# Altium project CTRL_Board.PrjPcb
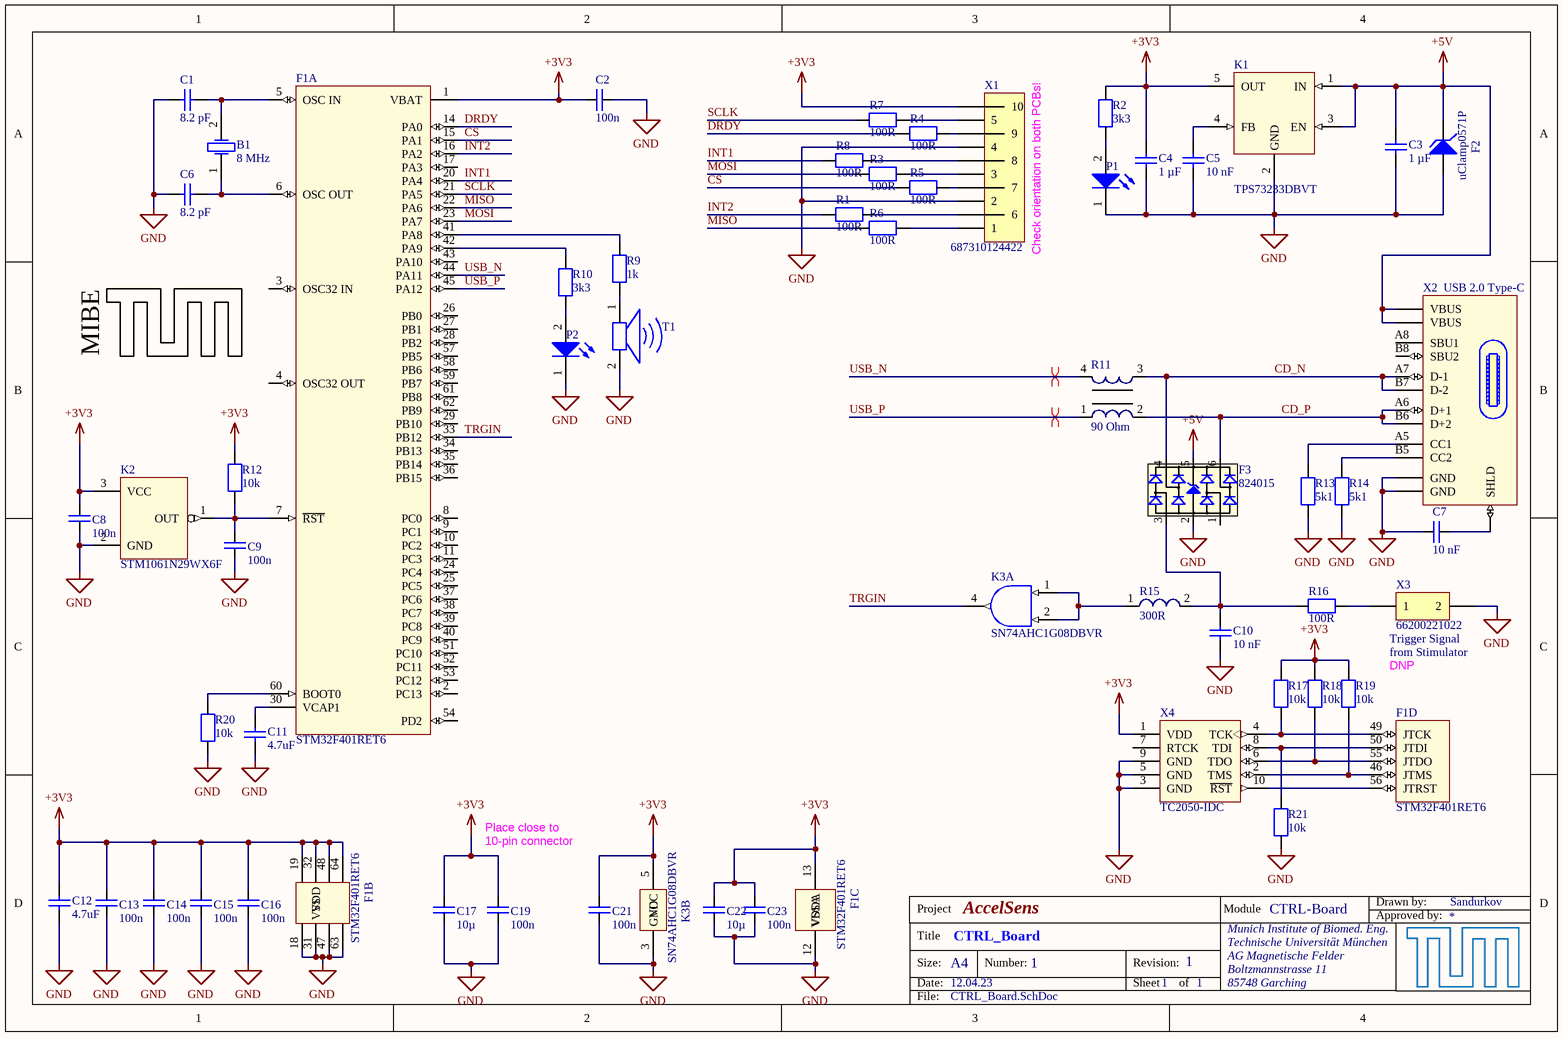
[diagram p0: CTRL_Board.SchDoc]
1 sheet, 57 parts. Net scope: global (net labels, ports and power ports of the same name join across sheets).
Board file: CTRL_Board.PcbDoc

## Sheet CTRL_Board.SchDoc: CTRL_Board
size A4; Date: 12.04.23; Engineer: Sandurkov; DocumentNumber: 1; Revision: 1; SheetNumber: 1; SheetTotal: 1; Module: CTRL-Board; Device: AccelSens

### Parts
*1  TUM & MIBE Logo  [TUM & MIBE Logo]  (value not drawn)  (no BOM)
B1  8 MHz  [DFN190P320X100-2N]
C1  8.2 pF  [CAPC1608X09N]
C2  100n  [CAPC1608X08N]
C3  1 µF  [CAPC2012X14N]
C4  1 µF  [CAPC2012X14N]
C5  10 nF  [CAPC2012X09N]
C6  8.2 pF  [CAPC1608X09N]
C7  10 nF  [0603 (1608x90N), h = 0.9 mm]
C8  100n  [CAPC1608X08N]
C9  100n  [CAPC1608X08N]
C10  10 nF  [CAPC2012X09N]
C11  4.7uF  [CAPC2012X09N]
C12  4.7uF  [CAPC2012X09N]
C13  100n  [CAPC1608X08N]
C14  100n  [CAPC1608X08N]
C15  100n  [CAPC1608X08N]
C16  100n  [CAPC1608X08N]
C17  10µ  [CAPC2012X14N]
C19  100n  [CAPC1608X08N]
C21  100n  [CAPC1608X08N]
C22  10µ  [CAPC2012X14N]
C23  100n  [CAPC1608X08N]
F1  STM32F401RET6  [LQFP-64]  (parts A,B,C,D of 4)
F2  uClamp0571P  [DFN110P160X55-2N]
F3  824015  [SOT23_6L]
K1  TPS73233DBVT  [SOT95P280X145-5N]
K2  STM1061N29WX6F  [SOT95P237X112-3N]
K3  SN74AHC1G08DBVR  [SOT95P280X145-5N]  (parts A,B of 2)
P1  green  [WL-SMCW_0603]  (value not drawn)
P2  green  [WL-SMCW_0603]  (value not drawn)
R1  100R  [RESC1608X05N]
R2  3k3  [RESC1608X05N]
R3  100R  [RESC1608X05N]
R4  100R  [RESC1608X05N]
R5  100R  [RESC1608X05N]
R6  100R  [RESC1608X05N]
R7  100R  [RESC1608X05N]
R8  100R  [RESC1608X05N]
R9  1k  [RESC1608X05N]
R10  3k3  [RESC1608X05N]
R11  90 Ohm  [WE-CNSW, 1206]
R12  10k  [RESC1608X05N]
R13  5k1  [RES0603]
R14  5k1  [RES0603]
R15  300R  [0603 (WE-CBF)]
R16  100R  [RESC1608X05N]
R17  10k  [RESC1608X05N]
R18  10k  [RESC1608X05N]
R19  10k  [RESC1608X05N]
R20  10k  [RESC1608X05N]
R21  10k  [RESC1608X05N]
T1  Summer  [PKLCS1212E4001-R1]  (value not drawn)
X1  687310124422  [687310124422]
X2  USB 2.0 Type-C  [629722000214]
X3  66200221022  [66200221022]
X4  TC2050-IDC  [TC2050-IDC]

### Nets
+3V3: C2.1 C4.1 C8.1 C12.1 C13.1 C14.1 C15.1 C16.1 C17.1 C19.1 C21.1 C22.1 C23.1 F1.1(VBAT) F1.13(VDDA) F1.19(VDD) F1.32(VDD) F1.48(VDD) F1.64(VDD) K1.5(OUT) K2.3(VCC) K3.5(VCC) R2.1 R12.1 R17.1 R18.1 R19.1 X1.10 X4.1(VDD)
+5V: C3.1 F2.1(C) F3.5(VDD) K1.1(IN) K1.3(EN) X2.VBUS
GND: C1.1 C2.2 C3.2 C4.2 C5.2 C6.1 C7.1 C8.2 C9.2 C10.2 C11.2 C12.2 C13.2 C14.2 C15.2 C16.2 C17.2 C19.2 C21.2 C22.2 C23.2 F1.12(VSSA) F1.18(VSS) F1.31(VSS) F1.47(VSS) F1.63(VSS) F2.2(A) F3.2(GND) K1.2(GND) K2.2(GND) K3.3(GND) P1.1(K) P2.1(K) R13.2 R14.2 R20.2 R21.2 T1.2 X1.2 X1.4 X2.GND X3.2 X4.3(GND) X4.5(GND) X4.9(GND)
CD_N: F3.4(I/O3) R11.3 X2.A7(D-1) X2.B7(D-2)
CD_P: F3.6(I/O4) R11.2 X2.A6(D+1) X2.B6(D+2)
CS: F1.15(PA1) R5.2
DRDY: F1.14(PA0) R4.2
INT1: F1.20(PA4) R8.2
INT2: F1.16(PA2) R1.2
MISO: F1.22(PA6) R6.2
MOSI: F1.23(PA7) R3.2
SCLK: F1.21(PA5) R7.2
TRGIN: F1.33(PB12) K3.4(Y)
USB_N: F1.44(PA11) R11.4
USB_P: F1.45(PA12) R11.1
NetB1_1: B1.1 C6.2 F1.6(OSC_OUT)
NetB1_2: B1.2 C1.2 F1.5(OSC_IN)
NetC5_1: C5.1 K1.4(FB)
NetC7_2: C7.2 X2.1(SHLD)
NetC9_1: C9.1 F1.7(~{RST}) K2.1(OUT) R12.2
NetC10_1: C10.1 F3.3(I/O2) R15.2 R16.1
NetC11_1: C11.1 F1.30(VCAP1)
NetF1_41: F1.41(PA8) R9.1
NetF1_42: F1.42(PA9) R10.2
NetF1_46: F1.46(JTMS) R19.2 X4.2(TMS)
NetF1_49: F1.49(JTCK) R17.2 X4.4(TCK)
NetF1_50: F1.50(JTDI) R21.1 X4.8(TDI)
NetF1_55: F1.55(JTDO) R18.2 X4.6(TDO)
NetF1_56: F1.56(JTRST) X4.10(~{RST})
NetF1_60: F1.60(BOOT0) R20.1
NetK3_1: K3.1(A) K3.2(B) R15.1
NetP1_2: P1.2(A) R2.2
NetP2_2: P2.2(A) R10.1
NetR1_1: R1.1 X1.6
NetR3_1: R3.1 X1.3
NetR4_1: R4.1 X1.9
NetR5_1: R5.1 X1.7
NetR6_1: R6.1 X1.1
NetR7_1: R7.1 X1.5
NetR8_1: R8.1 X1.8
NetR9_2: R9.2 T1.1
NetR13_1: R13.1 X2.A5(CC1)
NetR14_1: R14.1 X2.B5(CC2)
NetR16_2: R16.2 X3.1

Not connected (* = marked no-connect by the designer): F1 2(PC13) 3(OSC32_IN) 4(OSC32_OUT) 8(PC0) 9(PC1) 10(PC2) 11(PC3) 17(PA3) 24(PC4) 25(PC5) 26(PB0) 27(PB1) 28(PB2) 29(PB10) 34(PB13) 35(PB14) 36(PB15) 37(PC6) 38(PC7) 39(PC8) 40(PC9) 43(PA10) 51(PC10) 52(PC11) 53(PC12) 54(PD2) 57(PB5) 58(PB6) 59(PB7) 61(PB8) 62(PB9); F3 1(I/O1); X2 A8(SBU1) B8(SBU2); X4 7(RTCK)

### Layout directives
differential pair: USB_N, USB_P

### Notes on the sheet
- (near X1) Check orientation on both PCBs!
- (near X3) Trigger Signal
- from Stimulator
- DNP
- Place close to
- 10-pin connector
- Project
- Module
- Drawn by:
- Approved by:
- Title
- Size:
- Date:
- A4
- Number:
- Revision:
- Sheet
- of
- Munich Institute of Biomed. Eng.
- Technische Universität München
- AG Magnetische Felder
- Boltzmannstrasse 11
- 85748 Garching
- File:
- (in symbol TUM & MIBE Logo) MIBE

### Library data of the parts
B1 = NX3225GD-8MHZ-STD-CRA-3: Crystal, 8 MHz, 8 pF, NX3225GD; ComponentLink1Description: Datasheet; ComponentLink1URL: http://www.ndk.com/images/products/catalog/c_NX3225GD-STD-CRA-3_e.pdf
C1 C6 = C0603C829C5GACTU: 8.2 pF, 50 V, 5%, C0G, 0805; PackageReference: 0805; PackageDescription: Chip Capacitor, 2-Leads, Body 2,00x1,25mm, IPC Medium Density; Value: 8.2 pF; Supplier 1: Farnell; Supplier Part Number 1: 1865471; ComponentLink1Description: datasheet; ComponentLink1URL: http://www.farnell.com/datasheets/1691965.pdf?src-supplier=Element14
C2 C8 C9 C13-C16 C19 C21 C23 = C0603C104K5RACTU: 100n, 0603, X7R, 10%, 50 V; Manufacturer: Kemet; Voltage Rating: 50 V; Dielectric: X7R; Value: 100n; Tolerance: 10%; ComponentLink1Description: Datasheet; ComponentLink1URL: http://www.farnell.com/datasheets/1851736.pdf
  C2 C8 C9 C19 C21 C23: Supplier 1: Digi-Key; Supplier 2: Farnell; Supplier 3: Mouser; Supplier Part Number 1: 399-5089-1-ND; Supplier Part Number 2: 1288255; Supplier Part Number 3: 80-C0603C104K5R
C3 C4 = C0805C105K3RACTU: 1 µF, 25 V, 10%, X7R, 0805; PackageReference: 0805; PackageDescription: Chip Capacitor, 2-Leads, Body 2,00x1,25mm, IPC Medium Density; Value: 1 µF; Supplier 1: Digi-Key; Supplier 2: Farnell; Supplier 3: Mouser; Supplier Part Number 1: 399-8004-6-ND; Supplier Part Number 2: 1637035; Supplier Part Number 3: 80-C0805C105K3R; ComponentLink1Description: datasheet; ComponentLink1URL: https://content.kemet.com/datasheets/KEM_C1002_X7R_SMD.pdf
C5 C10 = C0805C103K5RACTU: 10 nF, 50 V, 10%, X7R, 0805; PackageReference: 0805; PackageDescription: Chip Capacitor, 2-Leads, Body 2,00x1,25mm, IPC Medium Density; Value: 10 nF; Supplier 1: Farnell; Supplier Part Number 1: 1414662; ComponentLink1Description: datasheet; ComponentLink1URL: https://datasheet.octopart.com/C0805C103K5RAC-TU-Kemet-datasheet-5313890.pdf
C7 = CC0603KRX7R9BB103: 10 nF, 50 V, 10%, X7R, 0603; Manufacturer: Yageo; Material: Ceramic; Capacitance: 10nF; Voltage Rating: 50V; Insulation Resistance: 100GR; Supplier 1: Future Electronics; Manufacturer Part Number: CC0603KRX7R9BB103; RoHS: Yes; Category: Ceramic Capacitors; Stock 1: 11624000; Pricing 1: 4000=0,00400, 20000=0,00380, 80000=0,00360, 200000=0,00350, 500000=0,00320 (USD); Mount: Surface Mount; Case/Package: 0603; Number of Pins: 2; Case Code (Metric): 1608; Case Code (Imperial): 0603; Min Operating Temperature: -55°C; Max Operating Temperature: 125°C; Tolerance: 10%; Packaging: Tape and Reel; Dielectric: X7R; Voltage: 50V; Voltage Rating (DC): 50V; Package Quantity: 1; Termination: SMD/SMT; Resistor Type: Ceramic; Series: CC; Length: 1.6mm; Width: 0.031inch; Height: 0.8mm; Thickness: 0.035inch; Depth: 0.8mm; Radiation Hardening: No; RoHS Compliant: Yes; Lead Free: Lead Free; Halogen Free: Halogen Free; ComponentLink1URL: https://datasheet.ciiva.com/11788/0900766b8079c870-11788374.pdf?src-supplier=Rs; ComponentLink1Description: https://datasheet.ciiva.com/11788/0900766b8079c870-11788374.pdf?src-supplier=Rs; ComponentLink2URL: https://datasheet.ciiva.com/26862/getdatasheetpartid-403582-26862846.pdf?src-supplier=Verical; ComponentLink2Description: https://datasheet.ciiva.com/26862/getdatasheetpartid-403582-26862846.pdf?src-supplier=Verical; ComponentLink3URL: https://datasheet.ciiva.com/8033/70765-8033817.pdf?src-supplier=Element14; ComponentLink3Description: https://datasheet.ciiva.com/8033/70765-8033817.pdf?src-supplier=Element14; ComponentLink4URL: https://datasheet.ciiva.com/28450/1489800-28450619.pdf?src-supplier=Element14; ComponentLink4Description: https://datasheet.ciiva.com/28450/1489800-28450619.pdf?src-supplier=Element14; ComponentLink5URL: https://datasheet.ciiva.com/176/mlccorderingcode-176551.pdf?src-supplier=Digi-Key; ComponentLink5Description: https://datasheet.ciiva.com/176/mlccorderingcode-176551.pdf?src-supplier=Digi-Key; ComponentLink6URL: https://datasheet.ciiva.com/176/mlccorderingcode-176550.pdf?src-supplier=Digi-Key; ComponentLink6Description: https://datasheet.ciiva.com/176/mlccorderingcode-176550.pdf?src-supplier=Digi-Key; ComponentLink7URL: https://datasheet.ciiva.com/176/mlccorderingcode-176552.pdf?src-supplier=Digi-Key; ComponentLink7Description: https://datasheet.ciiva.com/176/mlccorderingcode-176552.pdf?src-supplier=Digi-Key; ComponentLink8URL: https://datasheet.ciiva.com/13389/upy-gphc-x7r-6-3v-to-50v-8-13389991.pdf?src-supplier=Mouser; ComponentLink8Description: https://datasheet.ciiva.com/13389/upy-gphc-x7r-6-3v-to-50v-8-13389991.pdf?src-supplier=Mouser; ComponentLink9URL: https://datasheet.ciiva.com/8033/1734573-8033816.pdf?src-supplier=Element14; ComponentLink9Description: https://datasheet.ciiva.com/8033/1734573-8033816.pdf?src-supplier=Element14; ComponentLink10URL: https://datasheet.ciiva.com/8033/1734573-8033861.pdf?src-supplier=Element14; ComponentLink10Description: https://datasheet.ciiva.com/8033/1734573-8033861.pdf?src-supplier=Element14
C11 C12 = C0805C475K4PACTU: 4.7 µF, ± 10%, X5R, 16 V, 0805; PackageReference: 0805; PackageDescription: Chip Capacitor, 2-Leads, Body 2,00x1,25mm, IPC Medium Density; Value: 4.7uF; Supplier 1: Digi-Key; Supplier Part Number 1: 399-8101-2-ND; Supplier 2: Farnell; Supplier Part Number 2: 9227849; ComponentLink1Description: datasheet; ComponentLink1URL: http://www.farnell.com/datasheets/2739660.pdf?_ga=2.240630531.1432735279.1579189766-674608839.1579189766&_gac=1.140641798.1579263811.EAIaIQobChMIzJSvkNCK5wIVleJ3Ch2EjwqfEAAYASAAEgKpevD_BwE
C17 C22 = C0805C106K4PACTU: 10µ, 0805, X5R, 10%, 16 V; Manufacturer: Kemet; Voltage Rating: 16 V; Dielectric: X5R; Value: 10µ; Tolerance: 10%; ComponentLink1Description: Datasheet; ComponentLink1URL: http://www.farnell.com/datasheets/1732713.pdf; Supplier 1: Digi-Key; Supplier 2: Farnell; Supplier 3: Mouser; Supplier Part Number 1: 399-8012-1-ND; Supplier Part Number 2: 1288204; Supplier Part Number 3: 80-C0805C106K4P
F1 = STM32F401RET6: M4, 512 kB, 84 MHz; Manufacturer: STMicroelectronics; Interface: I2C,SPI,USB,IrDA,SDIO,UART,USART,LIN,I2S; Data Bus Width: 32b; Core Architecture: ARM; Operating Supply Voltage: 3.3V; Min Supply Voltage: 1.7V; Max Supply Voltage: 3.6V; RAM Size: 96KB; Number of I/Os: 50; Frequency: 84MHz; Memory Size: 512KB; Max Power Dissipation: 313mW; Number of Timers/Counters: 8; Oscillator Type: Internal; Watchdog Timer: Yes; Memory Type: FLASH; Peripherals: Brown-out Detect/Reset,POR,PWM,WDT,DMA; Supplier 1: Mouser; Manufacturer Part Number: STM32F401RET6; RoHS: Yes; Category: Microcontrollers; Stock 1: 9195; Pricing 1: 1=9,13, 10=8,26, 50=7,87, 100=6,84, 1000=5,06, 10000=5,06 (USD); Case/Package: LQFP; Number of Pins: 64; Weight: 0.012088oz; Min Operating Temperature: -40°C; Max Operating Temperature: 85°C; Packaging: Tray; Package Quantity: 960; Series: STM32 F4; Number of Programmable I/O: 50; Max Frequency: 84MHz; Radiation Hardening: No; Reach SVHC Compliant: No; Lead Free: Lead Free; RoHS Compliant: Yes; ComponentLink1URL: http://www.farnell.com/datasheets/1899788.pdf?src-supplier=Farnell; ComponentLink1Description: http://www.farnell.com/datasheets/1899788.pdf?src-supplier=Farnell; ComponentLink2URL: http://www.mouser.com/ds/2/389/stm32f401re-956236.pdf?src-supplier=Mouser; ComponentLink2Description: http://www.mouser.com/ds/2/389/stm32f401re-956236.pdf?src-supplier=Mouser; ComponentLink3URL: http://www.farnell.com/datasheets/1899788.pdf?src-supplier=Element14; ComponentLink3Description: http://www.farnell.com/datasheets/1899788.pdf?src-supplier=Element14; ComponentLink4URL: http://www.st.com/st-web-ui/static/active/en/resource/technical/document/datasheet/DM00102166.pdf?src-supplier=Avnet; ComponentLink4Description: http://www.st.com/st-web-ui/static/active/en/resource/technical/document/datasheet/DM00102166.pdf?src-supplier=Avnet; ComponentLink5URL: http://www.st.com/content/ccc/resource/technical/document/errata_sheet/df/f5/fd/26/37/db/42/2b/DM00095523.pdf/files/DM00095523.pdf/jcr:content/translations/en.DM00095523.pdf?src-supplier=Digi-Key; ComponentLink5Description: http://www.st.com/content/ccc/resource/technical/document/errata_sheet/df/f5/fd/26/37/db/42/2b/DM00095523.pdf/files/DM00095523.pdf/jcr:content/translations/en.DM00095523.pdf?src-supplier=Digi-Key; ComponentLink6URL: http://www.farnell.com/datasheets/1899788.pdf?src-supplier=Newark; ComponentLink6Description: http://www.farnell.com/datasheets/1899788.pdf?src-supplier=Newark
F2 = UCLAMP0571P.TNT: TVS DIODE 5V 15V SGP1610N2; Manufacturer: Semtech; Number of Unidirectional Channels: 1; Min Breakdown Voltage: 6V; Power Line Protection: No; Peak Pulse Current: 80A; Supplier 1: Digi-Key; Manufacturer Part Number: UCLAMP0571P.TNT; RoHS: Yes; Category: TVS Diodes; Stock 1: 30716; Pricing 1: 1=0,87000, 10=0,75800, 100=0,52470, 500=0,43842, 1000=0,37312, 2000=0,33231, 5000=0,31482 (USD); Mount: Surface Mount; Number of Pins: 2; Min Operating Temperature: -40°C; Max Operating Temperature: 125°C; Packaging: Tape and Reel; Reverse Standoff Voltage: 5V; Clamping Voltage: 15V; Resistor Type: Zener; ComponentLink1URL: https://media.digikey.com/pdf/Data%20Sheets/~No%20Display/Semtech%20PDFs/uClamp0571P-3671P.pdf?src-supplier=Digi-Key; ComponentLink1Description: https://media.digikey.com/pdf/Data%20Sheets/~No%20Display/Semtech%20PDFs/uClamp0571P-3671P.pdf?src-supplier=Digi-Key; ComponentLink2URL: http://www.mouser.com/ds/2/761/uclampxx71p_2-779780.pdf?src-supplier=Mouser; ComponentLink2Description: http://www.mouser.com/ds/2/761/uclampxx71p_2-779780.pdf?src-supplier=Mouser
F3 = WE-TVS-HS, 824015: TVS Diode WE-TVS-HS, VRWM=5V; Manufacturer: Würth Elektronik eiSos GmbH; Reverse Stand Off Voltage: 5V; Value: 824015; ComponentLink1Description: Manufacturer; ComponentLink1URL: http://www.we-online.de; Created by: Christin Zierenner; Created Date: March 2010; ComponentLink2Description: Datasheet; ComponentLink2URL: http://katalog.we-online.de/kataloge/eisos/media/pdf/824014.pdf; Supplier 1: Farnell; Supplier 2: Digi-Key; Supplier Part Number 1: 1748615; Supplier Part Number 2: 732-4467-1-ND
K1 = TPS73233DBVT: Low Noise, Positive Output LDO, 250 mA, 3.3V; Published: 15-May-2014; LatestRevisionDate: 15-May-2014; PackageReference: SOT23-5; Publisher: Stephan Huber; PackageDescription: SOT23, 5-Leads, Body 2,90x2,80mm, Pitch 0,95mm, IPC Medium Density; Value: TPS73233DBVT; Supplier 1: Digi-Key; Supplier Part Number 1: 296-15812-1-ND; ComponentLink1Description: datasheet; ComponentLink1URL: http://www.ti.com/lit/ds/symlink/tps732.pdf
K2 = STM1061N29WX6F: Low Power Voltage Detector, Open Drain, 2,9 V Threshold, SOT23-3; ComponentLink1Description: Datasheet; ComponentLink1URL: http://www.farnell.com/datasheets/1690459.pdf; Supplier 1: Digi-Key; Supplier 2: Farnell; Supplier 3: Mouser; Supplier Part Number 1: 497-4956-1-ND; Supplier Part Number 2: 1224452; Supplier Part Number 3: 511-STM1061N29WX6F
K3 = SN74AHC1G08DBVR: CMOS Single AND-Gate, AHC, 2 V - 5.5 V, 8 mA, Ultra High Speed; ComponentLink1Description: Datasheet; ComponentLink1URL: http://www.ti.com/lit/ds/symlink/sn74ahc1g08.pdf; Supplier 1: Digi-Key; Supplier 2: Mouser; Supplier Part Number 1: 296-1091-1-ND; Supplier Part Number 2: 595-SN74AHC1G08DBVR
P1 P2 = 150060VS75000: WL-SMCW LED, green, 30 mA, 2 V, 570 nmr, 0603, Bright Green,  140°; Forward Voltage: 2 V; Peak Wavelength: 572 nm; Dominant Wavelength: 570 nm; Luminous Intensity: 40 mcd; ComponentLink1Description: Manufacturer; ComponentLink1URL: http://www.we-online.de; ComponentLink2Description: Datasheet; ComponentLink2URL: http://katalog.we-online.de/led/datasheet/150060VS75000.pdf; Part Number: 150060VS75000; Published Date: March 2018; Publisher: Wurth Elektronik; Size: 0603; Viewing Angle: 140°; Operating Temperature: -40 to 85 degC; Emitting Color: Bright Green
R1 R3-R8 R16 = CRCW0603100RFKEAHP: 100R, 0603, 0.25 W, 1%, 75 V, pulse proof; Manufacturer: Vishay; Voltage Rating: 75 V; Power Rating: 0.25 W; Value: 100R; Tolerance: 1%; Series: CRCW-HP E3; ComponentLink1Description: datasheet; ComponentLink1URL: CRCW0603100RFKEAHP; Supplier 1: Digi-Key; Supplier 2: Farnell; Supplier 3: Mouser; Supplier Part Number 3: 71-CRCW0603100RFKEAH; Supplier Part Number 2: 1738891; Supplier Part Number 1: 541-100SCT-ND
R2 R10 = CRCW06033K30FKEA: 3k3, 0603, 0.1 W, 1%, 75 V; Manufacturer: Vishay; Voltage Rating: 75 V; Power Rating: 0.1 W; Value: 3k3; Tolerance: 1%; Series: D/CRCW E3
R9 = CRCW06031K00FKEA: 1k, 0603, 0.1 W, 1%, 75 V; Manufacturer: Vishay; Voltage Rating: 75 V; Power Rating: 0.1 W; Value: 1k; Tolerance: 1%; Series: D/CRCW E3; Supplier 1: Digi-Key; Supplier 2: Farnell; Supplier Part Number 1: 541-1.00KSCT-ND; Supplier Part Number 2: 2693105; ComponentLink1Description: datasheet; ComponentLink1URL: http://www.vishay.com/docs/20043/crcwhpe3.pdf?src-supplier=Digi-Key
R11 = WE-CNSW 1206, 744232090: SMD Common Mode Noise Suppressor WE-CNSW,  Z= 90 Ohm; Manufacturer: Würth Elektronik eiSos GmbH; partNo: 744232090; Impedance: 90 Ohm; ComponentLink1Description: Manufacturer; ComponentLink1URL: http://www.we-online.de; Created by: Christin Zierenner; Created Date: November 2009; ComponentLink2Description: Datasheet; ComponentLink2URL: http://www.we-online.de/katalog/media/pdf/744232090.pdf; Supplier 1: Digi-Key; Supplier 2: Farnell; Supplier 3: Mouser; Supplier Part Number 1: 732-1469-1-ND; Supplier Part Number 2: 1636474; Supplier Part Number 3: 710-744232090
R12 R20 = CRCW060310K0FKEA: 10k, 0603, 0.1 W, 1%, 75 V; Manufacturer: Vishay; Voltage Rating: 75 V; Power Rating: 0.1 W; Value: 10k; Tolerance: 1%; Series: D/CRCW E3; Supplier 1: Digi-Key; Supplier 2: Farnell; Supplier Part Number 1: 541-10.0KSCT-ND; Supplier Part Number 2: 1738918
R13 R14 = CRCW06035K10FKEA: 5k1, 0.1 W, 1%, 75 V, 0603; Manufacturer: Vishay; Resistance: 5.1kR; Temperature Coefficient: 100ppm/°C; Max Power Dissipation: 100mW; Voltage Rating: 75V; Supplier 1: Mouser; Manufacturer Part Number: CRCW06035K10FKEA; RoHS: Yes; Category: Chip SMD Resistors; Stock 1: 16936; Pricing 1: 1=0,1, 10=0,038, 50=0,038, 100=0,016, 1000=0,007, 10000=0,005 (USD); Case/Package: 0603; Contact Plating: Tin; Case Code (Imperial): 0603; Case Code (Metric): 1608; Weight: 7.1E-05oz; Size Code: 0603; Min Operating Temperature: -55°C; Max Operating Temperature: 155°C; Tolerance: 1%; Packaging: Tape and Reel; Series: CRCW; Number of Terminations: 2; Power Rating: 100mW; Package Quantity: 5000; Features: Automotive AEC-Q200; Construction: Rectangular; Resistor Type: Thick Film; Termination: SMD/SMT; Voltage Rating (DC): 75V; Resistance Tolerance: 1%; Technology: THICK FILM; Length: 1.55mm; Width: 0.85mm; Height: 0.45mm; Depth: 0.85mm; Radiation Hardening: No; Lead Free: Lead Free; RoHS Compliant: Yes; Military Standard: Not; Reach SVHC Compliant: Unknown; ComponentLink1URL: https://datasheet.ciiva.com/11809/0900766b80d98afc-11809935.pdf?src-supplier=Rs; ComponentLink1Description: https://datasheet.ciiva.com/11809/0900766b80d98afc-11809935.pdf?src-supplier=Rs; ComponentLink2URL: https://datasheet.ciiva.com/26314/fld-crcw-e3-data-en-26314742.pdf?src-supplier=Distrelec; ComponentLink2Description: https://datasheet.ciiva.com/26314/fld-crcw-e3-data-en-26314742.pdf?src-supplier=Distrelec; ComponentLink3URL: https://datasheet.ciiva.com/7690/1697337-7690728.pdf?src-supplier=Element14; ComponentLink3Description: https://datasheet.ciiva.com/7690/1697337-7690728.pdf?src-supplier=Element14; ComponentLink4URL: https://datasheet.ciiva.com/7690/1720486-7690873.pdf?src-supplier=Element14; ComponentLink4Description: https://datasheet.ciiva.com/7690/1720486-7690873.pdf?src-supplier=Element14; ComponentLink5URL: https://datasheet.ciiva.com/15159/getdatasheetpartid-32793-15159338.pdf?src-supplier=Verical; ComponentLink5Description: https://datasheet.ciiva.com/15159/getdatasheetpartid-32793-15159338.pdf?src-supplier=Verical; ComponentLink6URL: https://datasheet.ciiva.com/3257/dcrcwe3-3257758.pdf?src-supplier=Avnet; ComponentLink6Description: https://datasheet.ciiva.com/3257/dcrcwe3-3257758.pdf?src-supplier=Avnet; ComponentLink7URL: https://datasheet.ciiva.com/16226/dcrcwe3-16226862.pdf?src-supplier=Future+Electronics; ComponentLink7Description: https://datasheet.ciiva.com/16226/dcrcwe3-16226862.pdf?src-supplier=Future+Electronics
R15 = 742792641: 300R / 100 MHz, 2 A, 0R15, WE-CBF; Manufacturer: Wurth Electronics; Core Material: Ferrite; Max Current Rating: 2A; Number of Lines: 1; Test Frequency: 100MHz; Tolerance: 25%; Inductance: 18nH; Supplier 1: Rs; Manufacturer Part Number: 742792641; RoHS: Yes; Category: Ferrite Beads and Chips; Stock 1: 21100; Pricing 1: 500=0,165, 2500=0,149, 5000=0,134, 12500=0,12 (EUR); Mount: Surface Mount; Case/Package: SMD/SMT; Weight: 0.000141oz; Case Code (Metric): 1608; Case Code (Imperial): 0603; Material: Ferrite; Min Operating Temperature: -55°C; Max Operating Temperature: 125°C; Package Quantity: 1; Packaging: Tape and Reel; Impedance: 300R; Max DC Current: 2A; Termination: SMD/SMT; Series: WE-CBF; Current Rating: 2A; Length: 1.6mm; Width: 0.8mm; Height: 0.8mm; Depth: 0.8mm; RoHS Compliant: Yes; Lead Free: Lead Free; Reach SVHC Compliant: Unknown; ComponentLink1URL: https://datasheet.ciiva.com/1466/1705830-1466501.pdf?src-supplier=Element14; ComponentLink1Description: https://datasheet.ciiva.com/1466/1705830-1466501.pdf?src-supplier=Element14; ComponentLink2URL: https://datasheet.ciiva.com/4940/742792641-72209-4940450.pdf?src-supplier=Mouser; ComponentLink2Description: https://datasheet.ciiva.com/4940/742792641-72209-4940450.pdf?src-supplier=Mouser; ComponentLink3URL: https://datasheet.ciiva.com/1013/742792641-1013888.pdf?src-supplier=Digi-Key; ComponentLink3Description: https://datasheet.ciiva.com/1013/742792641-1013888.pdf?src-supplier=Digi-Key; ComponentLink4URL: https://datasheet.ciiva.com/11800/0900766b80d2e072-11800409.pdf?src-supplier=Rs; ComponentLink4Description: https://datasheet.ciiva.com/11800/0900766b80d2e072-11800409.pdf?src-supplier=Rs; ComponentLink5URL: https://datasheet.ciiva.com/1466/1705830-1466502.pdf?src-supplier=Element14; ComponentLink5Description: https://datasheet.ciiva.com/1466/1705830-1466502.pdf?src-supplier=Element14; ComponentLink6URL: https://datasheet.ciiva.com/1013/742792641-1013889.pdf?src-supplier=Digi-Key; ComponentLink6Description: https://datasheet.ciiva.com/1013/742792641-1013889.pdf?src-supplier=Digi-Key
R17-R19 R21 = ERA3AEB103V: 10k, 0603, 0.1 W, 0.1%, 75 V; Manufacturer: Panasonic; Voltage Rating: 75 V; Power Rating: 0.1 W; Value: 10k; Tolerance: 0.1%; Series: Metal Film (Thin Film) Chip Resistors, High Reliability Type; ComponentLink1Description: Datasheet; ComponentLink1URL: http://www.farnell.com/datasheets/2059650.pdf?_ga=1.210016598.299220673.1451381906
T1 = PKLCS1212E4001-R1: SUMMER, SMD, 4KHZ EXTERN BESCHALTEN; Value: Summer; PackageReference: Lead titanium zirconium oxide (16-Jun-2014); Supplier 1: Farnell; Supplier Part Number 1: 1192551; ComponentLink1Description: datasheet; ComponentLink1URL: http://www.farnell.com/datasheets/2157985.pdf?src-supplier=Element14
X1 = 687310124422: Ffc / Fpc Board Connector, Vertical, Surface Mount, Receptacle, 10, 0.5 Mm Rohs Compliant: Yes; Manufacturer: Wurth Electronics; Actuator Material: Polymer,Liquid Crystal Polymer; Actuator Color: Black; Current Rating: 500mA; Voltage Rating: 50V; Contact Location: Side; Number of Positions: 10; Insulation Resistance: 100MR; Mating Cycles: 25; Pitch: 0.5mm; Supplier 1: Rs; Manufacturer Part Number: 687310124422; RoHS: Yes; Category: FFC / FPC; Stock 1: 435; Pricing 1: 50=1,608, 250=1,488, 500=1,298, 1250=1,176 (EUR); Mount: Surface Mount; Contact Plating: Tin; Contact Material: Bronze,Tin; Housing Material: Liquid Crystal Polymer; Housing Color: Beige; Min Operating Temperature: -25°C; Max Operating Temperature: 85°C; Number of Rows: 2; Packaging: Tape and Reel; Package Quantity: 1; Termination: Solder; Gender: Receptacle; Number of Contacts: 10; Orientation: Straight; Series: WR-FPC; Length: 11.4mm; Width: 3.5mm; Lead Free: Lead Free; Flammability Rating: UL94 V-0; RoHS Compliant: Yes; Reach SVHC Compliant: Unknown; ComponentLink1URL: https://datasheet.ciiva.com/25617/0900766b81113c2b-25617817.pdf?src-supplier=Rs; ComponentLink1Description: https://datasheet.ciiva.com/25617/0900766b81113c2b-25617817.pdf?src-supplier=Rs; ComponentLink2URL: https://datasheet.ciiva.com/8067/1388844-8067302.pdf?src-supplier=Element14; ComponentLink2Description: https://datasheet.ciiva.com/8067/1388844-8067302.pdf?src-supplier=Element14; ComponentLink3URL: https://datasheet.ciiva.com/670/6873xx124422-670422.pdf?src-supplier=Digi-Key; ComponentLink3Description: https://datasheet.ciiva.com/670/6873xx124422-670422.pdf?src-supplier=Digi-Key; ComponentLink4URL: https://datasheet.ciiva.com/670/6873xx124422-670421.pdf?src-supplier=Digi-Key; ComponentLink4Description: https://datasheet.ciiva.com/670/6873xx124422-670421.pdf?src-supplier=Digi-Key; ComponentLink5URL: https://datasheet.ciiva.com/670/6873xx124422-670423.pdf?src-supplier=Digi-Key; ComponentLink5Description: https://datasheet.ciiva.com/670/6873xx124422-670423.pdf?src-supplier=Digi-Key; ComponentLink6URL: https://datasheet.ciiva.com/29317/709154-da-01-en-smd-zif-stecker-180grad-typ-a-10-pol-29317899.pdf?src-supplier=Conrad; ComponentLink6Description: https://datasheet.ciiva.com/29317/709154-da-01-en-smd-zif-stecker-180grad-typ-a-10-pol-29317899.pdf?src-supplier=Conrad
X2 = 629722000214: USB 2.0 Type C; Manufacturer: Wurth Electronics; Supplier 1: Farnell; Manufacturer Part Number: 629722000214; RoHS: No; Pricing 1: 1=2,78, 10=2,45, 100=2,3, 250=2,12, 500=2,01, 1000=1,8 (EUR)
X3 = WE-3.00 mm Micro Power Connector 66200221022: WR-MPC3 3.00 mm Male Dual Row Angled Header with Plastic Pegs; Manufacturer: W¨¹rth Elektronik eiSos GmbH; ComponentLink1 Description: Manufacturer; ComponentLink2 Description: Datasheet; NoPins: 02; Created Date: 20 August 2013; partNo: 66200221022; ComponentLink1URL: http://www.we-online.com; ComponentLink2URL: http://katalog.we-online.de/em/datasheet/6620xx21022.pdf; Created by: Karrer Zheng; ComponentLink1Description: New link; ComponentLink1URL: *; Supplier 1: RSComponents; Supplier Part Number 1: 8285940
X4 = TC2050-IDC: JTAG - Adapter Cbl Plug Of Nails 10PIN; Manufacturer: Tag-Connect; Supplier 1: Digi-Key; Manufacturer Part Number: TC2050-IDC; RoHS: Yes; Stock 1: 1744; Pricing 1: 1=39 (USD); Series: Plug-Of-Nails™; ComponentLink1URL: https://datasheet.ciiva.com/2385/tc2050-idc20datasheet-2385406.pdf?src-supplier=Digi-Key; ComponentLink1Description: https://datasheet.ciiva.com/2385/tc2050-idc20datasheet-2385406.pdf?src-supplier=Digi-Key